# EAGLE design EuroWizard (EAGLE 9.5.2)
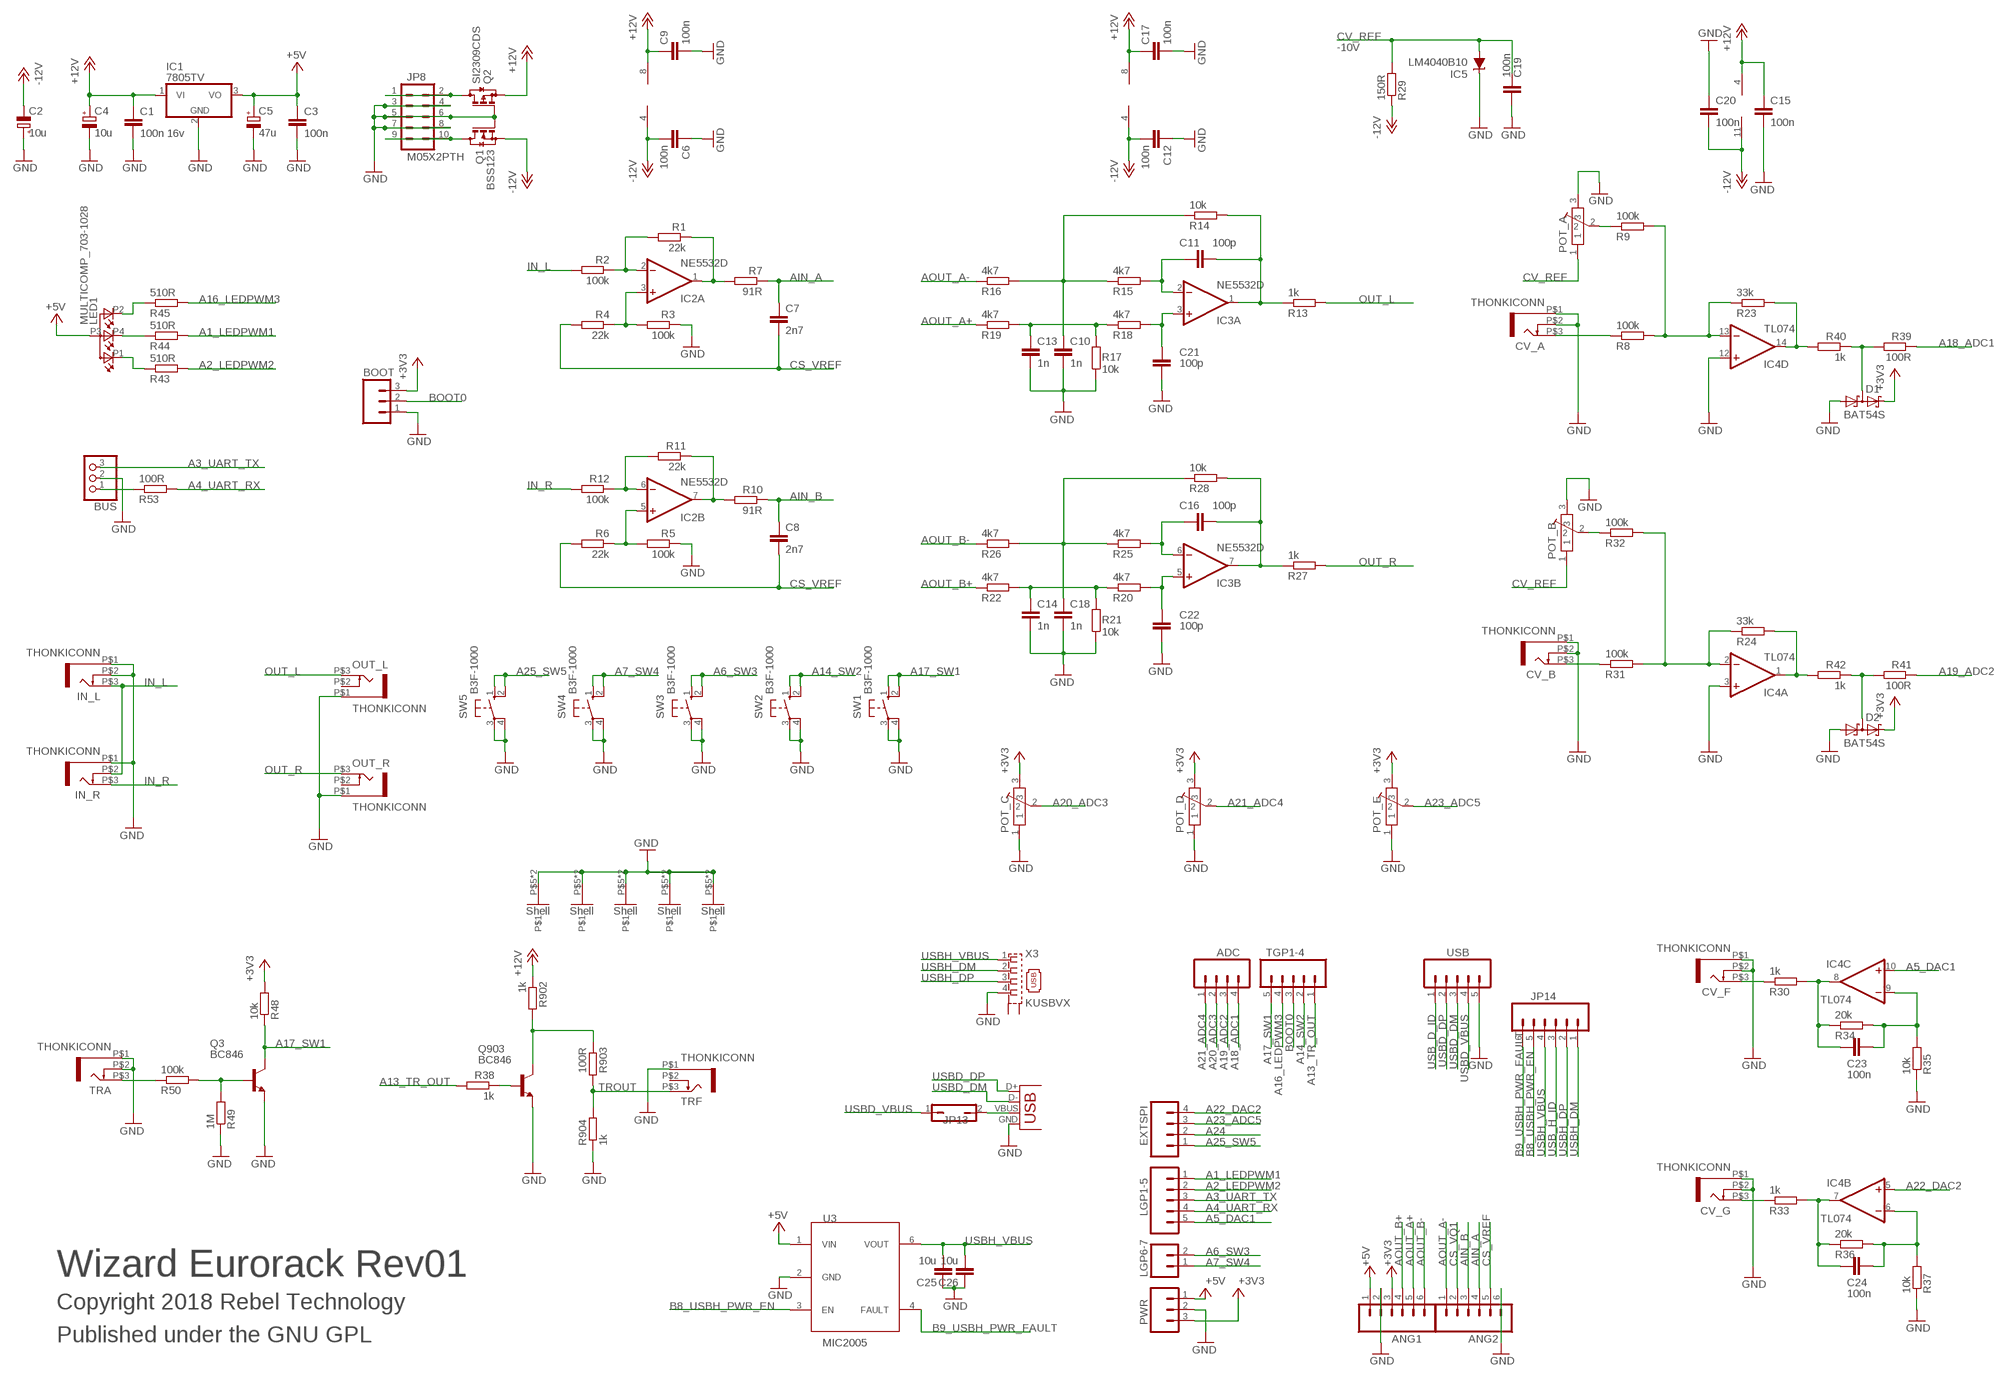
[diagram p0: schematic, sheet 1]

## Parts
ADC  M04PTH  [1X04]
ANG1  M06SIP  [1X06]
ANG2  M06SIP  [1X06]
BOOT  M03PTH  [1X03]
BUS  CON-JST-1X03PH-TH  [JST-B3B-PH-KL]
C1  100n 16v  C-EUC0603  [C0603]
C2  10u  CPOL-EUUD-4X5,8  [UD-4X5,8_NICHICON]
C3  100n  C-EUC0603  [C0603]
C4  10u  CPOL-EUUD-4X5,8  [UD-4X5,8_NICHICON]
C5  47u  CPOL-EUUD-4X5,8  [UD-4X5,8_NICHICON]
C6  100n  C-EUC0603  [C0603]
C7  2n7  C-EUC0603  [C0603]
C8  2n7  C-EUC0603  [C0603]
C9  100n  C-EUC0603  [C0603]
C10  1n  C-EUC0603  [C0603]
C11  100p  C-EUC0603  [C0603]
C12  100n  C-EUC0603  [C0603]
C13  1n  C-EUC0603  [C0603]
C14  1n  C-EUC0603  [C0603]
C15  100n  C-EUC0603  [C0603]
C16  100p  C-EUC0603  [C0603]
C17  100n  C-EUC0603  [C0603]
C18  1n  C-EUC0603  [C0603]
C19  100n  C-EUC0603  [C0603]
C20  100n  C-EUC0603  [C0603]
C21  100p  C-EUC0603  [C0603]
C22  100p  C-EUC0603  [C0603]
C23  100n  C-EUC0603  [C0603]
C24  100n  C-EUC0603  [C0603]
C25  10u  C-EUC0603  [C0603]
C26  10u  C-EUC0603  [C0603]
CV_A  THONKICONN  [THONKICONN]
CV_B  THONKICONN  [THONKICONN]
CV_F  THONKICONN  [THONKICONN]
CV_G  THONKICONN  [THONKICONN]
D1  BAT54S  [SOT23]
D2  BAT54S  [SOT23]
EXTSPI  M04PTH  [1X04]
IC1  7805TV  [TO220V]
IC2  NE5532D  [SO08]
IC3  NE5532D  [SO08]
IC4  TL074  QUAD_OPAMPD  [SO14]
IC5  LM4040B10  LM4041C12DBZ  [DBZ_R-PDSO-G3]
IN_L  THONKICONN  [THONKICONN]
IN_R  THONKICONN  [THONKICONN]
JP8  M05X2PTH  [AVR_ICSP]
JP13  JP1Q  [JP1]
JP14  M06SIP  [1X06]
LED1  MULTICOMP_703-1028  [RGB-LED-703-1028]
LGP1-5  M05PTH  [1X05]
LGP6-7  M02PTH  [1X02]
OUT_L  THONKICONN  [THONKICONN]
OUT_R  THONKICONN  [THONKICONN]
POT_A  POT-ALPS-RK09L1140  [POT-ALPS-RK09L1140]
POT_B  POT-ALPS-RK09L1140  [POT-ALPS-RK09L1140]
POT_C  POT-ALPS-RK09L1140  [POT-ALPS-RK09L1140]
POT_D  POT-ALPS-RK09L1140  [POT-ALPS-RK09L1140]
POT_E  POT-ALPS-RK09L1140  [POT-ALPS-RK09L1140]
PWR  M03PTH  [1X03]
Q1  BSS123  [SOT23]
Q2  SI2309CDS  BSS84  [SOT23]
Q3  BC846  [SOT23]
Q903  BC846  [SOT23]
R1  22k  R-EU_0603  [0603]
R2  100k  R-EU_0603  [0603]
R3  100k  R-EU_0603  [0603]
R4  22k  R-EU_0603  [0603]
R5  100k  R-EU_0603  [0603]
R6  22k  R-EU_0603  [0603]
R7  91R  R-EU_0603  [0603]
R8  100k  R-EU_0603  [0603]
R9  100k  R-EU_0603  [0603]
R10  91R  R-EU_0603  [0603]
R11  22k  R-EU_0603  [0603]
R12  100k  R-EU_0603  [0603]
R13  1k  R-EU_0603  [0603]
R14  10k  R-EU_0603  [0603]
R15  4k7  R-EU_0603  [0603]
R16  4k7  R-EU_0603  [0603]
R17  10k  R-EU_0603  [0603]
R18  4k7  R-EU_0603  [0603]
R19  4k7  R-EU_0603  [0603]
R20  4k7  R-EU_0603  [0603]
R21  10k  R-EU_0603  [0603]
R22  4k7  R-EU_0603  [0603]
R23  33k  R-EU_0603  [0603]
R24  33k  R-EU_0603  [0603]
R25  4k7  R-EU_0603  [0603]
R26  4k7  R-EU_0603  [0603]
R27  1k  R-EU_0603  [0603]
R28  10k  R-EU_0603  [0603]
R29  150R  R-EU_0603  [0603]
R30  1k  R-EU_0603  [0603]
R31  100k  R-EU_0603  [0603]
R32  100k  R-EU_0603  [0603]
R33  1k  R-EU_0603  [0603]
R34  20k  R-EU_0603  [0603]
R35  10k  R-EU_0603  [0603]
R36  20k  R-EU_0603  [0603]
R37  10k  R-EU_0603  [0603]
R38  1k  R-EU_0603  [0603]
R39  100R  R-EU_0603  [0603]
R40  1k  R-EU_0603  [0603]
R41  100R  R-EU_0603  [0603]
R42  1k  R-EU_0603  [0603]
R43  510R  R-EU_0603  [0603]
R44  510R  R-EU_0603  [0603]
R45  510R  R-EU_0603  [0603]
R48  10k  R-EU_0603  [0603]
R49  1M  R-EU_0603  [0603]
R50  100k  R-EU_0603  [0603]
R53  100R  R-EU_0603  [0603]
R902  1k  R-EU_0603  [0603]
R903  100R  R-EU_0603  [0603]
R904  1k  R-EU_0603  [0603]
SW1  B3F-1000  10-XX  [B3F-10XX]
SW2  B3F-1000  10-XX  [B3F-10XX]
SW3  B3F-1000  10-XX  [B3F-10XX]
SW4  B3F-1000  10-XX  [B3F-10XX]
SW5  B3F-1000  10-XX  [B3F-10XX]
TGP1-4  M05PTH  [1X05]
TRA  THONKICONN  [THONKICONN]
TRF  THONKICONN  [THONKICONN]
U3  MIC2005  [SOT23-6]
USB  M05PTH  [1X05]
X3  KUSBVX  [KUSBVX]
X5  USBPTH-VERTICAL  [USB-B-PTH-VERTICAL]

## Nets
+3V3: ANG1.3 BOOT.3 D1.2(C2) D2.2(C2) POT_C.3 POT_D.3 POT_E.3 PWR.3 R48.2
+5V: ANG1.1 C3.1 C5.+ IC1.3(VO) LED1.P3(A) PWR.1 U3.1(VIN)
+12V: C1.1 C4.+ C9.1 C15.1 C17.1 IC1.1(VI) IC2.8(P:V+) IC3.8(P:V+) IC4.4(P:V+) Q2.2(S) R902.1
-12V: C2.- C6.2 C12.2 C20.2 IC2.4(P:V-) IC3.4(P:V-) IC4.11(P:V-) Q1.2(S) R29.1
A1_LEDPWM1: LGP1-5.1 R44.2
A2_LEDPWM2: LGP1-5.2 R43.2
A3_UART_TX: BUS.3 LGP1-5.3
A4_UART_RX: LGP1-5.4 R53.2
A5_DAC1: IC4.10(C:+IN) LGP1-5.5
A6_SW3: LGP6-7.2 SW3.1(S) SW3.2(S1)
A7_SW4: LGP6-7.1 SW4.1(S) SW4.2(S1)
A13_TR_OUT: R38.2 TGP1-4.1
A14_SW2: SW2.1(S) SW2.2(S1) TGP1-4.2
A16_LEDPWM3: R45.2 TGP1-4.4
A17_SW1: Q3.3(C) R48.1 SW1.1(S) SW1.2(S1) TGP1-4.5
A18_ADC1: ADC.4 R39.1
A19_ADC2: ADC.3 R41.1
A20_ADC3: ADC.2 POT_C.2
A21_ADC4: ADC.1 POT_D.2
A22_DAC2: EXTSPI.4 IC4.5(B:+IN)
A23_ADC5: EXTSPI.3 POT_E.2
A24: EXTSPI.2
A25_SW5: EXTSPI.1 SW5.1(S) SW5.2(S1)
AIN_A: ANG2.4 C7.1 R7.1
AIN_B: ANG2.3 C8.1 R10.1
AOUT_A+: ANG1.5 R19.1
AOUT_A-: ANG2.1 R16.1
AOUT_B+: ANG1.4 R22.1
AOUT_B-: ANG1.6 R26.1
B8_USBH_PWR_EN: JP14.5 U3.3(EN)
B9_USBH_PWR_FAULT: JP14.6 U3.4(FAULT)
BOOT0: BOOT.2 TGP1-4.3
CS_VQ1: ANG2.2
CS_VREF: ANG2.5 C7.2 C8.2 R4.2 R6.2
CV_REF: C19.1 IC5.2(A) POT_A.1 POT_B.1 R29.2
EXT_UART_RX: BUS.1 R53.1
GND: ANG1.2 ANG2.6 BOOT.1 BUS.2 C1.2 C2.+ C3.2 C4.- C5.- C6.1 C9.2 C10.2 C12.1 C13.2 C14.2 C15.2 C17.2 C18.2 C19.2 C20.1 C21.2 C22.2 C25.1 C26.1 CV_A.P$1 CV_A.P$2 CV_B.P$1 CV_B.P$2 CV_F.P$1 CV_F.P$2 CV_G.P$1 CV_G.P$2 D1.1(A1) D2.1(A1) IC1.2(GND) IC4.3(A:+IN) IC4.12(D:+IN) IC5.1(C) IN_L.P$1 IN_L.P$2 IN_R.P$1 JP8.3 JP8.4 JP8.5 JP8.6 JP8.7 JP8.8 OUT_L.P$1 OUT_R.P$1 POT_A.3 POT_A.P$5 POT_A.P$6 POT_B.3 POT_B.P$5 POT_B.P$6 POT_C.1 POT_C.P$5 POT_C.P$6 POT_D.1 POT_D.P$5 POT_D.P$6 POT_E.1 POT_E.P$5 POT_E.P$6 PWR.2 Q1.1(G) Q2.1(G) Q3.2(E) Q903.2(E) R3.1 R5.1 R17.1 R21.1 R35.1 R37.1 R49.1 R904.1 SW1.3(P) SW1.4(P1) SW2.3(P) SW2.4(P1) SW3.3(P) SW3.4(P1) SW4.3(P) SW4.4(P1) SW5.3(P) SW5.4(P1) TRA.P$1 TRA.P$2 TRF.P$1 U3.2(GND) USB.5 X3.4 X5.GND
IN_L: IN_L.P$3 IN_R.P$2 R2.2
IN_R: IN_R.P$3 R12.2
N$1: IC2.1(A:OUT) R1.1 R7.2
N$2: IC2.3(A:+IN) R3.2 R4.1
N$3: CV_A.P$3 R8.1
N$4: IC2.5(B:+IN) R5.2 R6.1
N$5: IC2.6(B:-IN) R11.2 R12.1
N$6: CV_F.P$3 R30.1
N$7: C11.1 IC3.2(A:-IN) R15.2
N$8: JP8.9 JP8.10 Q1.3(D)
N$9: IC2.2(A:-IN) R1.2 R2.1
N$10: IC2.7(B:OUT) R10.2 R11.1
N$11: C21.1 IC3.3(A:+IN) R18.2
N$12: JP8.1 JP8.2 Q2.3(D)
N$13: IC4.13(D:-IN) R8.2 R9.2 R23.1
N$14: POT_A.2 R9.1
N$15: C13.1 R17.2 R18.1 R19.2
N$16: D1.3(C1A2) R39.2 R40.1
N$17: IC4.14(D:OUT) R23.2 R40.2
N$18: C16.2 IC3.7(B:OUT) R27.1 R28.2
N$19: CV_B.P$3 R31.1
N$20: IC4.2(A:-IN) R24.1 R31.2 R32.2
N$21: POT_B.2 R32.1
N$22: IC4.1(A:OUT) R24.2 R42.2
N$23: D2.3(C1A2) R41.2 R42.1
N$24: C18.1 R25.1 R26.2 R28.1
N$25: C23.2 IC4.8(C:OUT) R30.2 R34.1
N$26: C16.1 IC3.6(B:-IN) R25.2
N$27: JP13.2 X5.VBUS
N$28: CV_G.P$3 R33.1
N$29: C23.1 IC4.9(C:-IN) R34.2 R35.2
N$30: C22.1 IC3.5(B:+IN) R20.2
N$31: C24.2 IC4.7(B:OUT) R33.2 R36.1
N$32: C14.1 R20.1 R21.2 R22.2
N$33: C24.1 IC4.6(B:-IN) R36.2 R37.2
N$37: Q3.1(B) R49.2 R50.2
N$39: C11.2 IC3.1(A:OUT) R13.1 R14.2
N$40: LED1.P1(CRED) R43.1
N$41: C10.1 R14.1 R15.1 R16.2
N$42: LED1.P2(CGREEN) R45.1
N$43: LED1.P4(CBLUE) R44.1
N$46: R50.1 TRA.P$3
N$47: Q903.1(B) R38.1
N$51: Q903.3(C) R902.2 R903.1
OUT_L: OUT_L.P$3 R13.2
OUT_R: OUT_R.P$3 R27.2
TROUT: R903.2 R904.2 TRF.P$3
USB_D_ID: USB.1
USB_H_ID: JP14.3
USBD_DM: USB.3 X5.D-
USBD_DP: USB.2 X5.D+
USBD_VBUS: JP13.1 USB.4
USBH_DM: JP14.1 X3.2
USBH_DP: JP14.2 X3.3
USBH_VBUS: C25.2 C26.2 JP14.4 U3.6(VOUT) X3.1
Unconnected: OUT_L.P$2 OUT_R.P$2 TRF.P$2 X3.M1(S1) X3.M2(S2)

## Notes on the sheet
- -10V
- Wizard Eurorack Rev01
- Copyright 2018 Rebel Technology
- Published under the GNU GPL

## Library data of the parts
ADC EXTSPI = SparkFun:M04: Header 4 Standard 4-pin 0.1" header. Use with straight break away headers (SKU : PRT-00116), right angle break away headers (PRT-00553), swiss pins (PRT-00743), machine pins (PRT-00117), and female headers (PRT-00115). Molex polarized connector foot print use with SKU : PRT-08231 with associated crimp pins and housings. 1MM SMD Version SKU: PRT-10208
ANG1 ANG2 JP14 = SparkFun:M06: Header 6 Standard 6-pin 0.1" header. Use with straight break away headers (SKU : PRT-00116), right angle break away headers (PRT-00553), swiss pins (PRT-00743), machine pins (PRT-00117), and female headers (PRT-00115). Molex polarized connector foot print use with SKU : PRT-08094 with associated crimp pins and housings. NOTES ON THE VARIANTS LOCK and LOCK_LONGPADS... This footprint was designed to help hold the alignment of a through-hole component (i.e. 6-pin header) while soldering it into place. You may notice that each hole has been shifted either up or down by 0.005 of an inch from it's more standard position (which is a perfectly straight line). This slight alteration caused the pins (the squares in the middle) to touch the edges of the holes. Because they are alternating, it causes a "brace" to hold the component in place. 0.005 has proven to be the perfect amount of "off-center" position when using our standard breakaway headers. Although looks a little odd when you look at the bare footprint, once you have a header in there, the alteration is very hard to notice. Also, if you push a header all the way into place, it is covered up entirely on the bottom side. This idea of altering the position of holes to aid alignment will be further integrated into the Sparkfun Library for other footprints. It can help hold any component with 3 or more connection pins.
BOOT PWR = SparkFun:M03: Header 3 Standard 3-pin 0.1" header. Use with straight break away headers (SKU : PRT-00116), right angle break away headers (PRT-00553), swiss pins (PRT-00743), machine pins (PRT-00117), and female headers (PRT-00115). Molex polarized connector foot print use with SKU : PRT-08232 with associated crimp pins and housings.
BUS = Rebel:CON-JST-1X03
C1 C3 C23 C24 = Rebel:C-EU: CAPACITOR, European symbol
C2 C4 = Rebel:CPOL-EU: POLARIZED CAPACITOR, European symbol
C5 = rcl:CPOL-EU: POLARIZED CAPACITOR, European symbol
C6-C22 C25 C26 = resistor:C-EU: CAPACITOR, European symbol
CV_A CV_B CV_F CV_G IN_L IN_R OUT_L OUT_R TRA TRF = Rebel:THONKICONN
D1 D2 = diode:BAT54S: Schottky Diodes Pin connection corrected 2011-05-04 Source: Fairchild .. BAT54.pdf
IC1 = linear:78*: Positive VOLTAGE REGULATOR Source: http://cache.national.com/ds/LM/LM78L05.pdf http://www.fairchildsemi.com/ds/LM/LM7805.pdf
IC2 IC3 = linear:NE5532: AUDIO AMPLIFIER
IC4 = adafruit:QUAD_OPAMP: OP AMP Standard quad package
IC5 = texas:LM4041: PRECISION MICROPOWER SHUNT VOLTAGE REFERENCE Source: http://focus.ti.com/lit/ds/slcs146e/slcs146e.pdf; MF: TEXAS INSTRUMENT CONNECTORS; MPN: LM4041C12QDBZT; OC_FARNELL: 1771733; OC_NEWARK: 43K3376
JP8 = SparkFun:M05X2: Header 5x2 Standard 10-pin dual row 0.1" header. Commonly used with AVR-ISP. Use with Spark Fun Electronics SKU: PRT-00778
JP13 = jumper:JP1Q: JUMPER
LED1 = Rebel:MULTICOMP_703-1028: Farnell: 2112143
LGP1-5 TGP1-4 USB = SparkFun:M05: Header 5 Standard 5-pin 0.1" header. Use with straight break away headers (SKU : PRT-00116), right angle break away headers (PRT-00553), swiss pins (PRT-00743), machine pins (PRT-00117), and female headers (PRT-00115). Molex polarized connector foot print use with SKU : PRT-08230 with associated crimp pins and housings.
LGP6-7 = SparkFun:M02: Header 2 Standard 2-pin 0.1" header. Use with straight break away headers (SKU : PRT-00116), right angle break away headers (PRT-00553), swiss pins (PRT-00743), machine pins (PRT-00117), and female headers (PRT-00115). Molex polarized connector foot print use with SKU : PRT-08233 with associated crimp pins and housings.
POT_A POT_B POT_C POT_D POT_E = Rebel:POT-ALPS-RK09L
Q1 = transistor-small-signal:BSS123: N-CHANNEL MOS FET; OC_FARNELL: 1843725
Q2 = transistor-small-signal:BSS84: P-CHANNEL MOS FET; OC_FARNELL: 1779264
Q3 Q903 = transistor:BC846: NPN TRANSISTOR
R1-R45 R48-R50 R53 R902-R904 = Rebel:R-EU_: RESISTOR, European symbol
SW1-SW5 = switch-omron:10-XX: OMRON SWITCH; MPN: B3F-1000; OC_FARNELL: 176432; OC_NEWARK: 36M3542
U3 = James:MIC2005; OC_FARNELL: 2509882
X3 = con-kycon:KUSBVX: Vertical,Top Entry Universal Serial Bus Connector KUSBVX Series Source: KYCON Sibalco USB vertical socket KUSBV.pdf
X5 = SparkFun:USB: USB Connectors USB-B-PTH is fully proven SKU : PRT-00139 USB-miniB is fully proven SKU : PRT-00587 USB-A-PCB is untested. USB-A-H is throughly reviewed, but untested. Spark Fun Electronics SKU : PRT-00437 USB-B-SMT is throughly reviewed, but untested. Needs silkscreen touching up. USB-A-S has not been used/tested USB-MB-H has not been used/tested

## Net classes
1 power: width 0.178 mm, drill 0.305 mm, clearance 0.178 mm to class 0, clearance 0.178 mm

## Board
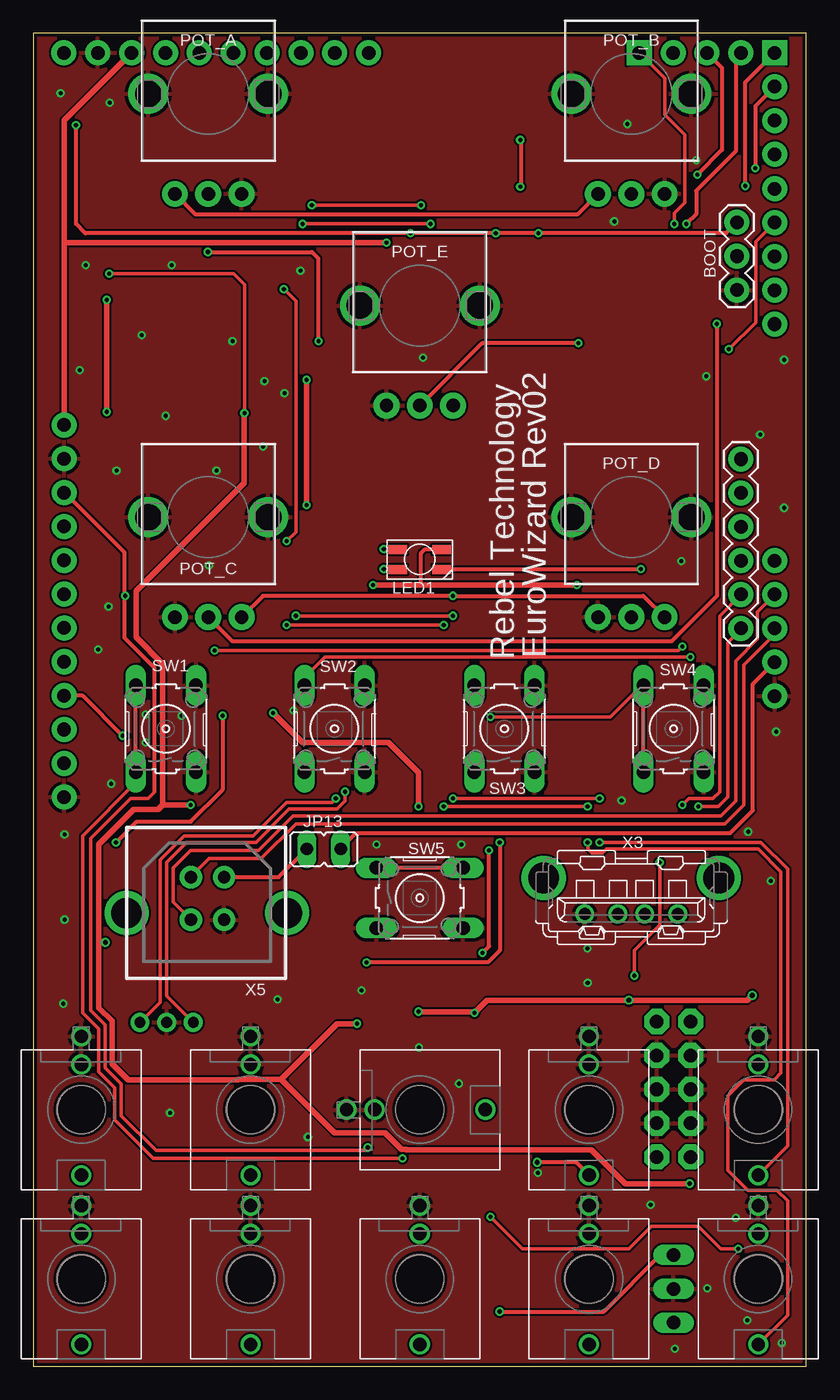
[diagram p1: board, top side]
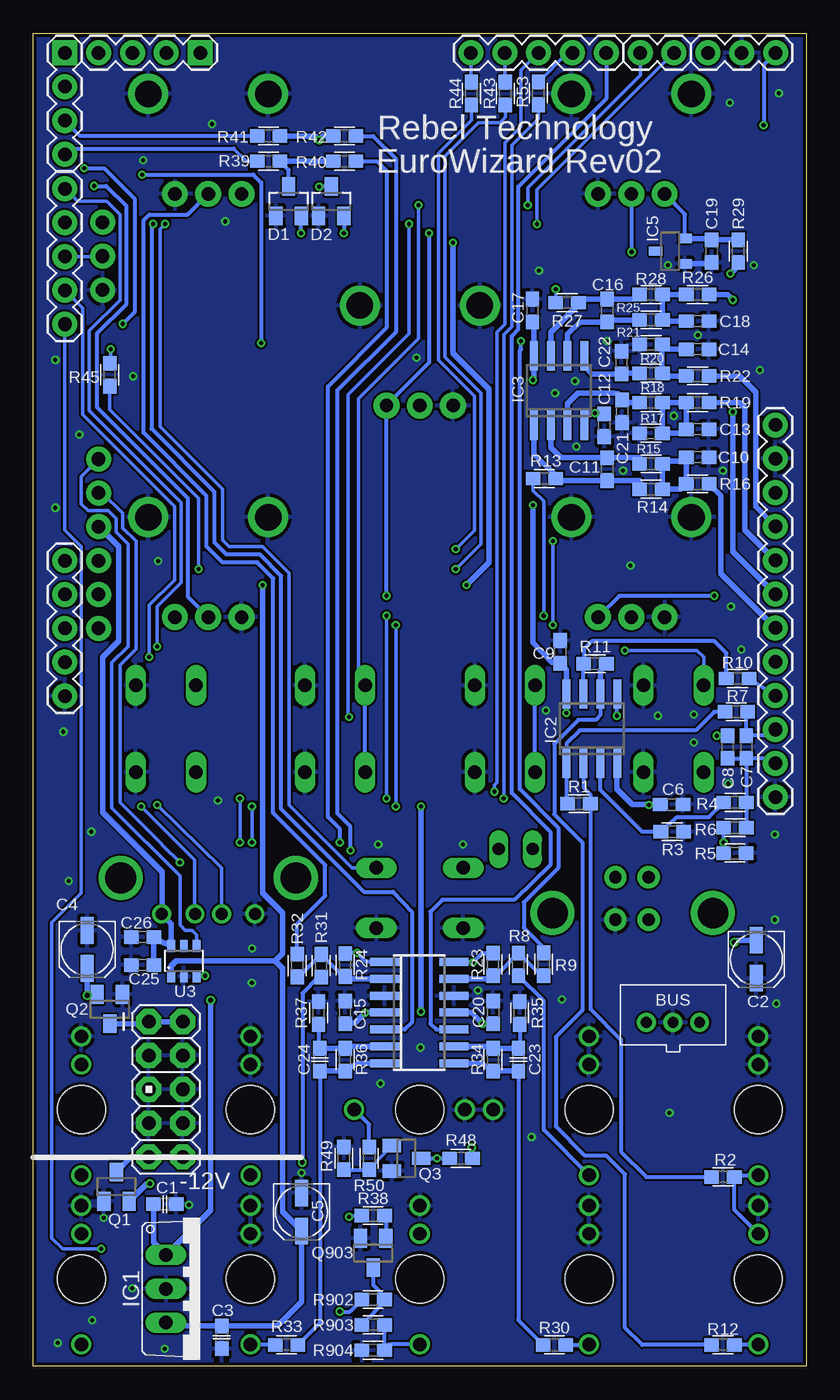
[diagram p2: board, bottom side, seen from below]

Size 58 x 100 mm. Coordinates in mm from the lower left corner, seen from the top.
Outline: 0,0 58,0 58,100 0,100 0,0
Copper layers (1*16): Top 0.035mm / dielectric 1.5mm / Bottom 0.035mm
Design rules "SeeedStudio_2layer_DRU_no_angle_20140221": minimum track width 6mil, minimum drill 12mil, track to track 6mil, track to pad 6mil, pad to pad 6mil, via to via 6mil, smd to smd 0mil, copper to edge 10mil, drill to drill 10mil, minimum pad ring 10mil, minimum via ring 6mil, stop-mask expansion 2mil, vias tented up to drill 100mil, thermal gap 10mil

### Footprints (pad centres in the part's own frame; a part is rotated, then mirrored left to right if it is on the bottom)
1X04 = drill 1.016 pad 1.88 square: 1 0,0 | drill 1.016 pad 1.88: 2 2.54,0; 3 5.08,0; 4 7.62,0
1X06 = drill 1.016 pad 1.88: 1 0,0; 2 2.54,0; 3 5.08,0; 4 7.62,0; 5 10.16,0; 6 12.7,0
1X03 = drill 1.016 pad 1.88: 1 0,0; 2 2.54,0; 3 5.08,0
JST-B3B-PH-KL = drill 0.8 pad 1.422: 1 2,0; 2 0,0; 3 -2,0
C0603 = smd 1.1 x 1: 1 -0.85,0; 2 0.85,0
UD-4X5,8_NICHICON = smd 2 x 1: + 1.425,0; - -1.425,0
THONKICONN = drill 1: P$1 0,-5.5; P$2 0,-3.38; P$3 0,4.92 | hole 3.6: 0,0
SOT23 = smd 1 x 1.4: 1 -0.95,-1.1; 2 0.95,-1.1; 3 0,1.1
TO220V = drill 1.016 long: 1 -2.54,-2.54; 2 0,-2.54; 3 2.54,-2.54
SO08 = smd 0.6 x 2.2: 1 -1.905,-2.6; 2 -0.635,-2.6; 3 0.635,-2.6; 4 1.905,-2.6; 5 1.905,2.6; 6 0.635,2.6; 7 -0.635,2.6; 8 -1.905,2.6
SO14 = smd 0.6 x 2.2: 1 -3.81,-2.6; 2 -2.54,-2.6; 3 -1.27,-2.6; 4 0,-2.6; 5 1.27,-2.6; 6 2.54,-2.6; 7 3.81,-2.6; 8 3.81,2.6; 9 2.54,2.6; 10 1.27,2.6; 11 0,2.6; 12 -1.27,2.6; 13 -2.54,2.6; 14 -3.81,2.6
DBZ_R-PDSO-G3 = smd 0.7 x 1: 1 -0.95,-1.1; 2 0.95,-1.1; 3 0,1.1
AVR_ICSP = drill 1.016 pad 1.88 octagon: 1 -1.27,5.08; 2 1.27,5.08; 3 -1.27,2.54; 4 1.27,2.54; 5 -1.27,0; 6 1.27,0; 7 -1.27,-2.54; 8 1.27,-2.54; 9 -1.27,-5.08; 10 1.27,-5.08
JP1 = drill 0.914 long: 1 0,-1.27; 2 0,1.27
RGB-LED-703-1028 = smd 0.7 x 1.4: P1 -0.75,1.65; P2 -0.75,-1.65; P3 0.75,-1.65; P4 0.75,1.65
1X05 = drill 1.016 pad 1.88: 1 0,0; 2 2.54,0; 3 5.08,0; 4 7.62,0; 5 10.16,0
1X02 = drill 1.016 pad 1.88: 1 0,0; 2 2.54,0
POT-ALPS-RK09L1140 = drill 1 pad 1.93: 1 -2.5,-7.5; 2 0,-7.5; 3 2.5,-7.5 | drill 2: P$5 -4.5,0; P$6 4.5,0
0603 = smd 1.1 x 1: 1 -0.85,0; 2 0.85,0
B3F-10XX = drill 1.016 long: 1 -3.251,2.261; 2 3.251,2.261; 3 -3.251,-2.261; 4 3.251,-2.261
SOT23-6 = smd 0.6 x 0.9: 1 -0.95,-1.15; 2 0,-1.15; 3 0.95,-1.15; 4 0.95,1.15; 5 0,1.15; 6 -0.95,1.15
KUSBVX = drill 0.9 pad 1.3: 1 3.5,0; 2 1,0; 3 -1,0; 4 -3.5,0 | drill 2.3 pad 2.8: M1 -6.57,2.71; M2 6.57,2.71
USB-B-PTH-VERTICAL = drill 0.914 pad 1.676: D+ 4.826,4.394; D- 4.826,7.595; GND 7.315,4.394; VBUS 7.315,7.595 | drill 2.286: P$1 0,4.902; P$2 12.04,4.902

### Placement (x,y rotation side)
ADC  55.64,98.54 270 bottom
ANG1  2.31,70.62 270 bottom
ANG2  2.31,55.39 270 bottom
BOOT  52.8,80.74 90 top
BUS  10,25.8 0 bottom
C1  48.13,12.16 0 bottom
C2  3.74,30.53 270 bottom
C3  43.86,2.17 270 bottom
C4  53.96,31.27 270 bottom
C5  37.87,11.57 270 bottom
C6  10.1,42.14 180 bottom
C7  4.5,46.46 270 bottom
C8  5.9,46.46 270 bottom
C9  18.46,53.6 90 bottom
C10  8.14,68.2 0 bottom
C11  14.94,67.3 270 bottom
C12  15.16,70.6 90 bottom
C13  8.14,70.3 0 bottom
C14  8.14,76.3 0 bottom
C15  34.6,26.54 90 bottom
C16  14.94,79.2 90 bottom
C17  20.54,79.2 90 bottom
C18  8.14,78.4 0 bottom
C19  7.1,83.66 270 bottom
C20  23.5,26.54 270 bottom
C21  13.82,71.64 270 bottom
C22  13.86,75.29 90 bottom
C23  21.6,23 270 bottom
C24  36.5,23 270 bottom
C25  49.8,30.1 0 bottom
C26  49.8,32.2 0 bottom
CV_A  16.3,19.25 180 top
CV_B  41.7,19.25 180 top
CV_F  16.3,6.55 180 top
CV_G  41.7,6.55 180 top
D1  38.84,87.4 0 bottom
D2  35.64,87.4 0 bottom
EXTSPI  45.48,98.54 180 bottom
IC1  45.5,5.8 270 bottom
IC2  16.08,47.83 0 bottom
IC3  18.54,73.2 0 bottom
IC4  29.03,26.53 270 bottom
IC5  10.2,83.66 90 bottom
IN_L  3.6,19.25 180 top
IN_R  3.6,6.55 180 top
JP8  48.06,20.77 0 bottom
JP13  21.8,38.8 90 top
JP14  53.1,55.36 90 top
LED1  29,60.52 90 top
LGP1-5  25.16,98.54 0 bottom
LGP6-7  9.92,98.54 180 bottom
OUT_L  54.4,19.25 180 top
OUT_R  54.4,6.55 180 top
POT_A  13.12,95.45 0 top
POT_B  44.88,95.45 0 top
POT_C  13.12,63.7 0 top
POT_D  44.88,63.7 0 top
POT_E  29,79.58 0 top
PWR  7.38,98.54 0 bottom
Q1  51.76,13.47 0 bottom
Q2  52.26,26.8 180 bottom
Q3  30,15.6 270 bottom
Q903  32.5,8.5 180 bottom
R1  17.04,42.2 0 bottom
R2  6.24,14.2 0 bottom
R3  10.06,40.1 180 bottom
R4  5.34,42.3 0 bottom
R5  5.36,38.5 180 bottom
R6  5.34,40.4 0 bottom
R7  5.24,49.1 180 bottom
R8  21.6,30.14 90 bottom
R9  19.7,30.16 270 bottom
R10  5.14,51.6 180 bottom
R11  15.84,52.7 0 bottom
R12  6.24,1.6 0 bottom
R13  19.64,66.6 180 bottom
R14  11.64,65.8 180 bottom
R15  11.64,67.7 180 bottom
R16  8.14,66.2 180 bottom
R17  11.64,70 0 bottom
R18  11.64,72.3 180 bottom
R19  8.14,72.3 180 bottom
R20  11.64,74.5 180 bottom
R21  11.64,76.65 0 bottom
R22  8.14,74.3 180 bottom
R23  23.5,30.14 90 bottom
R24  34.6,30.1 90 bottom
R25  11.64,78.5 180 bottom
R26  8.14,80.4 180 bottom
R27  17.94,79.8 180 bottom
R28  11.64,80.4 180 bottom
R29  5.1,83.66 90 bottom
R30  18.9,1.6 180 bottom
R31  36.4,30.04 90 bottom
R32  38.2,30.06 270 bottom
R33  39,1.6 0 bottom
R34  23.5,23 90 bottom
R35  21.5,26.5 270 bottom
R36  34.6,23 90 bottom
R37  36.6,26.5 270 bottom
R38  32.5,11.3 180 bottom
R39  40.34,90.4 0 bottom
R40  34.64,90.4 0 bottom
R41  40.34,92.3 0 bottom
R42  34.64,92.3 0 bottom
R43  22.58,95.48 90 bottom
R44  25.12,95.48 90 bottom
R45  52.26,74.38 90 bottom
R48  25.9,15.6 0 bottom
R49  34.7,15.6 270 bottom
R50  32.8,15.6 270 bottom
R53  20.1,95.5 90 bottom
R902  32.5,5 0 bottom
R903  32.5,3.1 0 bottom
R904  32.5,1.2 0 bottom
SW1  9.95,47.83 90 top
SW2  22.6,47.83 90 top
SW3  35.35,47.83 90 top
SW4  48.05,47.83 90 top
SW5  29,35.12 0 top
TGP1-4  55.64,78.18 90 bottom
TRA  29,19.25 270 top
TRF  29,6.55 180 top
U3  46.7,30.4 0 bottom
USB  55.64,60.44 270 bottom
X3  44.88,33.92 0 top
X5  7,29.1 0 top

### Tracks (layer width: path | path; a pad name or v marks a point on that pad's centre or on a via)
+3V3  (via drill 0.3)
  Top 0.254: v25.1,16.4 24.9,16.2 9.2,16.2 6.6,18.8 6.6,21.2 5.4,22.4 5.4,25.6 4.3,26.7 4.3,39.6 7.3,42.6 8.6,42.6 9.1,43.1
  Top 0.305: POT_D.3 45.77,57.8 v31.5,57.8 17.23,57.8 POT_C.3 | BOOT.3 51.98,85 v37.9,85 v34.7,85 v28.3,85 3.9,85 3.2,85.7 v3.2,93.1 | ANG1.3 2.36,65.54 6.85,61.05 6.85,57.75 | 9.1,43.1 9.1,52.4 6.85,54.65 6.85,57.75 | v6.9,57.8 6.85,57.75
  Bottom 0.254: R48.2 25.1,15.65 v25.1,16.4
  Bottom 0.305: v37.9,85 D1.2 | PWR.3 3.2,97.64 v3.2,93.1 | v28.3,85 28.3,75.3 31.5,72.1 POT_E.3 31.52,72.1 31.52,57.83 v31.5,57.8 | D2.2 v34.69,85.01 v34.7,85 | v6.9,57.8 14.03,57.8 POT_C.3
+5V  (via drill 0.3)
  Top 0.305: 29.1,58.6 29.1,61 29.4,61.3 30.62,61.3 LED1.P3
  Top 0.406: ANG1.1 2.31,84.3 | PWR.1 2.31,93.47 2.31,84.3 | v40.8,58.6 29.1,58.6 v25.5,58.6 | v26.5,84.3 2.31,84.3
  Bottom 0.406: v40.8,58.6 40.8,35.5 39.3,34 39.3,30.97 39.87,30.4 | v26.5,84.3 26.5,76 23.8,73.3 23.8,60.3 v25.5,58.6 | IC1.3 47.8,3.02 C3.1 39.68,3.02 37.87,4.83 C5.+ 39.3,11.58 39.3,29.83 39.87,30.4 | U3.1 47.65,30.04 47.29,30.4 39.87,30.4
+12V  (via drill 0.3, 0.35)
  Top 0.305: 33,26.6 v33.1,26.5 | 47.04,8.34 42.8,4.1 v35,4.1
  Top 0.406: v20.5,74 v20.5,64.6 | v18,49 20.2,46.8 26.65,46.8 28.9,44.55 v28.9,42 | v28.9,26.6 33,26.6 | v33.1,26.5 34.05,27.45 v44.69,27.45 53.59,27.45 v53.96,27.82 | 47.04,8.34 IC1.1
  Bottom 0.305: v35,4.1 34.25,4.1 R902.1 | C9.1 18.51,52.8 | 20.45,74.06 v20.5,74 | 17.98,49.02 v18,49 | 33.07,26.53 v33.1,26.5
  Bottom 0.406: C17.1 20.44,78.55 20.44,78.05 | 20.44,77.3 20.44,78.05 | 20.44,78.05 20.45,76.35 IC3.8 20.45,74.06 | 34.65,25.84 C15.1 34.55,25.74 33.86,25.74 v33.1,26.5 | C9.1 17.98,52.27 IC2.8 17.98,49.02 | 18.51,52.8 19.1,52.8 20.5,54.3 v20.5,64.6 | v28.9,42 v28.9,26.6 | IC4.4 33.07,26.53 | C1.1 48.98,9.28 IC1.1 44.69,11.69 v44.69,27.45 | C4.+ v53.96,27.82 53.28,27.82 Q2.2
-12V  (via drill 0.3, 0.35)
  Top 0.254: 15.8,71.44 v15.84,71.5 15.84,81.16 15.04,81.96 v5.7,81.96
  Top 0.406: 4.9,32 4.9,26.9 5.9,25.9 5.9,22.7 7.1,21.5 15.36,21.5 15.37,21.51 18.59,21.51 | 4.9,32 4.9,39.15 7.52,41.77 9.37,41.77 9.7,42.1 | 9.7,42.1 v11.8,42.1 | 9.7,42.1 9.7,52.7 7.7,54.7 7.7,58.14 15.8,66.24 15.8,71.44 | v5.4,31.8 5.1,31.8 4.9,32 | v49.26,13.7 44.43,13.7 41.89,16.24 27.99,16.24 27.97,16.26 27.65,16.26 26.4,17.51 22.59,17.51 18.59,21.51 | v24.3,25.7 22.79,25.7 18.59,21.51
  Bottom 0.254: v11.8,42.1 10.99,42.1 C6.2
  Bottom 0.305: 14.2,45.2 IC2.4
  Bottom 0.406: C12.2 15.79,71.45 | IC3.4 16.54,71.45 15.79,71.45 | v15.84,71.5 15.79,71.45 | v5.7,81.96 5.1,82.56 R29.1 | IC4.11 25.13,26.53 v24.3,25.7 C20.2 | C6.2 13.04,42.14 14.2,43.3 14.2,45.2 | C2.- 5.25,31.95 v5.4,31.8 | Q1.2 49.48,13.7 v49.26,13.7
A1_LEDPWM1
  Bottom 0.254: R44.2 25.16,96.37 LGP1-5.1
A2_LEDPWM2
  Bottom 0.254: R43.2 22.62,96.37 LGP1-5.2
A3_UART_TX  (via drill 0.3)
  Top 0.254: BUS.3 10,27.8 10,37.8 11.5,39.3 16.7,39.3 19.2,41.8 22.8,41.8 23.4,42.4 v23.4,43.1
  Bottom 0.254: LGP1-5.3 21.4,97.22 21.4,93 22.6,91.8 22.6,78.2 23.2,77.6 23.2,43.8 23.4,43.6 v23.4,43.1
A4_UART_RX
  Bottom 0.254: 17.5,98.54 LGP1-5.4 17.91,98.54 R53.2
A5_DAC1
  Bottom 0.305: LGP1-5.5 15,95.1 21.6,88.5 21.6,77.8 22.1,77.3 22.1,43 19.2,40.1 19.2,37.6 21.9,35 27.3,35 28.2,34.1 28.2,25.7 27.76,25.26 IC4.10
A6_SW3  (via drill 0.3)
  Top 0.254: v20.9,87.1 v29.1,87.1
  Bottom 0.254: LGP6-7.2 12.46,96.84 20.9,88.4 v20.9,87.1 | v29.1,87.1 29.1,77.1 33.61,72.59 33.61,51.59 SW3.2
  Bottom 0.305: SW3.1 SW3.2
A7_SW4  (via drill 0.3)
  Top 0.254: SW4.2 45.68,51.08 43.3,48.7 v34.3,48.7 | v29.8,85.7 v20.2,85.7
  Top 0.305: SW4.1 SW4.2
  Bottom 0.254: LGP6-7.1 20.2,88.25 v20.2,85.7 | v34.3,48.7 34.36,48.76 34.36,72.89 29.8,77.45 v29.8,85.7
A13_TR_OUT  (via drill 0.3)
  Top 0.254: v34.3,11.2 36.7,8.8 44.68,8.8 46.39,10.51 49.89,10.51 51.6,8.8 v52.9,8.8
  Bottom 0.254: TGP1-4.1 55.64,62.74 54.4,61.5 54.4,35.5 56.6,33.3 56.6,9.6 55.8,8.8 v52.9,8.8 | v34.3,11.2 34.2,11.3 R38.2
A14_SW2  (via drill 0.3)
  Top 0.254: v49.3,53.2 21.9,53.2 20.4,51.7 20.4,51.14 SW2.2
  Bottom 0.254: TGP1-4.2 54.3,79.38 54.3,71.4 47.4,64.5 47.4,59 49.3,57.1 v49.3,53.2
  Bottom 0.305: SW2.1 SW2.2
A16_LEDPWM3  (via drill 0.3)
  Top 0.254: TGP1-4.4 54.2,84.36 54.2,78.3 v52.2,76.3
  Bottom 0.254: v52.2,76.3 52.2,75.23 R45.2
A17_SW1  (via drill 0.3)
  Top 0.254: v13.61,53.7 48.4,53.7 v48.7,54 | SW1.1 7.69,43.79 3.7,39.8 3.7,26.5 4.9,25.3 4.9,22.1 6.1,20.9 6.1,18.5 9,15.6 v27.7,15.6
  Top 0.305: SW1.1 SW1.2
  Bottom 0.254: v48.7,54 48.7,57 46.9,58.8 46.9,64.8 53.8,71.7 53.8,77.7 51.5,80 51.5,86.4 52.49,87.39 54.69,87.39 TGP1-4.5 | v13.61,53.7 8.2,53.7 7.7,53.2 SW1.2
  Bottom 0.305: Q3.3 v27.7,15.6 R48.1
A18_ADC1
  Bottom 0.254: 42.96,91.36 42,90.4 R39.1
  Bottom 0.305: ADC.4 55.19,91.36 42.96,91.36
A19_ADC2
  Bottom 0.305: ADC.3 54.48,92.3 47.1,92.3 47.09,92.29 46.59,92.29 46.58,92.3 R41.1
A20_ADC3  (via drill 0.3)
  Top 0.305: POT_C.2 14.93,54.4 47.9,54.4 51.3,57.8 v51.3,78.2 | ADC.2 54.19,94.55 v54.19,89.87
  Bottom 0.305: v54.19,89.87 52.66,89.87 50.4,87.61 50.4,79.1 v51.3,78.2
A21_ADC4  (via drill 0.3)
  Top 0.305: v53.43,88.55 53.43,96.33 ADC.1
  Bottom 0.305: POT_D.2 46.4,57.73 46.4,65.1 53.2,71.9 53.2,77.5 51,79.7 51,87.02 52.53,88.55 v53.43,88.55
A22_DAC2  (via drill 0.3)
  Top 0.305: EXTSPI.4 53.1,98.52 52.7,98.12 52.7,91.14 49.74,88.19 49.74,86.44 v49,85.7
  Bottom 0.305: IC4.5 30.14,25.26 29.6,25.8 29.6,34.1 31,35.6 33.2,35.6 39.4,41.8 39.4,59.3 41,60.9 43.5,60.9 44.4,61.8 44.4,65.6 49.13,70.33 49.13,85.57 v49,85.7
A23_ADC5  (via drill 0.3)
  Top 0.305: EXTSPI.3 51.68,97.41 51.68,91.25 v49.83,89.4 | POT_E.2 33.67,76.75 v40.9,76.75
  Bottom 0.305: v49.83,89.4 41.5,89.4 40.9,88.8 v40.9,76.75
A25_SW5  (via drill 0.3)
  Top 0.254: EXTSPI.1 47.4,96.61 47.4,93.9 48.9,92.4 48.9,87.3 48.1,86.5 v48.1,85.7
  Top 0.305: SW5.2 SW5.1
  Bottom 0.254: SW5.2 34.09,37.39 38.8,42.1 38.8,59.5 40.8,61.5 43.3,61.5 43.8,62 43.8,65.8 48.48,70.48 48.48,85.32 v48.1,85.7
AIN_A
  Bottom 0.305: ANG2.4 2.77,47.31 C7.1 4.49,49 R7.1
AIN_B  (via drill 0.3)
  Top 0.305: v6.7,47.3 3.69,50.31 ANG2.3
  Bottom 0.305: 3.1,50.31 ANG2.3 R10.1 | v6.7,47.3 C8.1
AOUT_A+
  Bottom 0.406: 2.28,60.46 ANG1.5 4.6,62.75 4.6,71.9 5,72.3 R19.1
AOUT_A-
  Bottom 0.406: ANG2.1 6.4,59.48 6.4,65.31 R16.1
AOUT_B+
  Bottom 0.406: 2.34,62.96 2.34,63 ANG1.4 3.8,64.49 3.8,73.1 5,74.3 R22.1
AOUT_B-  (via drill 0.3)
  Top 0.406: v5.5,71.6 v5.5,80
  Bottom 0.406: ANG1.6 5.5,61.11 v5.5,71.6 | R26.1 5.9,80.4 v5.5,80
B8_USBH_PWR_EN  (via drill 0.3)
  Top 0.254: v47,37.8 47,33.1 45.1,31.2 v45.1,29.3
  Bottom 0.254: JP14.5 52.82,65.52 51.3,64 51.3,62.9 50.3,61.9 50.3,53.8 51.5,52.6 51.5,42.3 48.5,39.3 48.25,39.05 v47,37.8 | U3.3 45.25,29.25 v45.1,29.3
B9_USBH_PWR_FAULT
  Bottom 0.254: U3.4 45.75,32.35 46.1,32.7 46.6,32.7 47,33.1 47,36.8 52.1,41.9 52.1,52.8 50.9,54 50.9,61.7 51.8,62.6 51.8,63.6 52.4,64.2 53.9,64.2 54.4,64.7 54.4,66.75 JP14.6
BOOT0
  Bottom 0.254: BOOT.2 52.82,83.26 TGP1-4.3
CS_VREF
  Bottom 0.305: C8.2 C7.2 | C7.2 R4.2 R6.2 | ANG2.5 2.69,45.61 C7.2
CV_REF
  Top 0.305: POT_B.1 40.83,86.4 12.18,86.4 POT_A.1
  Bottom 0.305: 7.1,84.61 C19.1 | IC5.2 9.1,86.42 POT_A.1
  Bottom 0.406: R29.2 C19.1 | 7.1,84.61 IC5.2
EXT_UART_RX  (via drill 0.3)
  Top 0.254: BUS.1 9.5,27.3 9.5,38 11.3,39.8 16.5,39.8 19,42.3 22.4,42.3 v22.7,42.6
  Bottom 0.254: R53.1 20.1,93.6 22.1,91.6 22.1,78 22.7,77.4 v22.7,42.6
GND  (via drill 0.3)
  Bottom 0.305: 7.2,82.71 C19.2
  Bottom 0.406: IC5.1 7.2,82.71
  other vias: 18.84,73 11.14,48.8 10.39,82.61 19.54,49.2 46.32,12.11 50.57,5.84 6.24,67.2 9.94,71.3 13.74,67.2 17.24,69 17.34,73.9 8.14,77.36 14.94,76.9 53.57,3.44 52.71,11.14 4.88,53.77 5.64,57 8.44,48.9 8.44,46.8 5.84,43.7 2.34,39.9 2.24,27.2 2.34,33.5 24.64,28.2 56.17,1.74 55.74,47.6 53.64,40.1 55.34,36.4 10.25,19 48.14,1.3 41.58,31.33 20.6,17.19 41.6,28.75 13.18,60.08 2.04,95.5 5.74,94.8 3.94,82.6 3.47,74.73 20.04,82.2 44.59,93.2 49.76,90.49 43.59,85.89 54.54,69.9 56.34,75.5 56.34,64.4 48.64,60.4 44.15,42.44 31.94,21.2 28.94,23.9 18.34,27.52 32.11,39.14 25.77,39.14 37.86,14.5 29.25,75.66 50.51,74.27
  pour Bottom: -1.16,-0.97 -1.16,101.3 59.44,101.3 59.44,-0.97
  pour Top: -1.06,-0.97 -0.96,101.3 59.04,101.3 58.94,-0.97
IN_L
  Bottom 0.305: IN_L.P$3 5.39,14.33 R2.2 5.39,11.72 IN_R.P$2
IN_R
  Bottom 0.305: R12.2 5.39,1.63 IN_R.P$3
N$1
  Bottom 0.305: R7.2 6.9,49.1 8.3,47.7 17,47.7 17.98,46.72 IC2.1 17.98,42.3 R1.1
  Bottom 0.406: IC2.1 17.94,45.27
N$2
  Bottom 0.305: IC2.3 15.45,43.24 12.3,40.1 R3.2 9.69,41.2 7.29,41.2 R4.1
N$3
  Bottom 0.305: CV_A.P$3 19.7,17.73 19.7,27.39 R8.1
N$4  (via drill 0.3)
  Top 0.305: v14.2,48.8 14.2,43.24 11.82,40.85 7.76,40.85 v6.2,39.29
  Bottom 0.305: R5.2 6.19,38.52 v6.19,39.28 | v6.19,39.28 R6.1 | v6.19,39.28 v6.2,39.29 | v14.2,48.8 14.2,50.41 IC2.5
  Bottom 0.406: 14.14,50.4 IC2.5
N$5
  Bottom 0.305: R12.1 12.3,1.6 13.6,2.9 13.6,14.4 15,15.8 16.6,15.8 18.8,18 18.8,24.7 16.8,26.7 16.8,39.3 18.9,41.4 18.9,46.7 17.1,48.5 15.8,48.5 15.45,48.85 IC2.6
  Bottom 0.406: IC2.6 15.45,52.24 R11.2
N$6
  Bottom 0.305: R30.1 16.33,1.6 CV_F.P$3
N$7
  Bottom 0.406: R15.2 12.49,68.15 C11.1 18.39,68.15 19.18,68.94 IC3.2
N$8
  Bottom 0.406: JP8.10 49.26,15.69 JP8.9 50.64,15.69 Q1.3
N$9
  Bottom 0.305: R2.1 12,14.2 13.9,16.1 13.9,24.5 16.19,26.79 R1.2 16.2,42.9 16.71,43.41 IC2.2
N$10
  Bottom 0.305: IC2.7 16.71,52.67 R11.1 16.7,53.8 16.1,54.4 6.9,54.4 5.99,53.49 R10.2
N$11
  Bottom 0.406: R18.2 13.34,72.3 13.82,72.78 | IC3.3 17.91,72.23 17.14,73 14.44,73 14.12,72.98 13.82,72.78 | C21.1 13.82,72.78
N$12
  Bottom 0.406: JP8.1 49.26,25.85 | 49.26,25.85 JP8.2 | Q2.3 49.41,25.7 49.26,25.85
N$13
  Bottom 0.305: R23.1 23.3,29.29 R8.2 19.92,29.31 R9.2
  Bottom 0.406: IC4.13 23.82,29.07 R23.1
N$14  (via drill 0.3)
  Top 0.305: v13.1,83.6 20.9,83.6 21.4,83.1 v21.4,76.9
  Bottom 0.305: POT_A.2 13.12,83.62 v13.1,83.6 | R9.1 19.7,31.4 21.2,32.9 21.2,34.8 18.6,37.4 18.6,40.4 21.5,43.3 21.5,76.2 21.4,76.3 v21.4,76.9
N$15
  Bottom 0.406: 9.04,72.3 R18.1 R17.2 9.29,70 C13.1 R19.2
N$16
  Bottom 0.305: D1.3 38.84,89.75 R39.2
  Bottom 0.406: R40.1 R39.2
N$17  (via drill 0.3)
  Top 0.305: v35,39.3 35,31.2 34.1,30.3 v25,30.3
  Bottom 0.305: R40.2 32.2,90.4 31.5,89.7 31.5,77.9 35.9,73.5 35.9,41.2 35,40.3 v35,39.3 | R23.2 24.31,30.99 v25,30.3 26.43,30.3 IC4.14
N$18
  Bottom 0.406: R28.2 12.84,80.05 C16.2 16.69,80.05 17.09,79.65 | IC3.7 19.18,77.56 17.09,79.65 | R27.1 17.09,79.65
N$19  (via drill 0.35)
  Top 0.305: v37.81,15.3 37.83,15.28 40.75,15.28 CV_B.P$3
  Bottom 0.305: R31.1 36.6,29.19 37.81,27.98 v37.81,15.3
N$20
  Bottom 0.305: R24.1 34.76,29.25 R31.2 38.08,29.21 R32.2
  Bottom 0.406: IC4.2 34.42,29.07 R24.1
N$21
  Bottom 0.305: R32.1 38.2,33.2 36.1,35.3 36.1,37.6 40,41.5 40,59.1 41.2,60.3 43.8,60.3 45,61.5 45,65.3 49.74,70.04 49.74,85.96 49.3,86.4 46.42,86.4 POT_B.2
N$22  (via drill 0.3)
  Top 0.305: v33.7,31 34.2,31.5 v34.2,38.7
  Bottom 0.305: IC4.1 33.04,30.34 v33.7,31 34.55,31 R24.2 34.6,31.05 | R42.2 32.5,92.3 30.8,90.6 30.8,77.6 35.2,73.2 35.2,41.5 34.2,40.5 v34.2,38.7
N$23  (via drill 0.3)
  Top 0.305: v36.54,92 36.6,91.9 36.6,88.5 v36.54,88.5
  Bottom 0.305: D2.3 v36.54,88.5
  Bottom 0.406: R42.1 36.24,92.3 v36.54,92 36.84,92.3 R41.2
N$24
  Bottom 0.406: R26.2 R28.1 R25.1 10.69,78.4 C18.1
N$25
  Bottom 0.305: C23.2 21.6,3.45 R30.2
  Bottom 0.406: C23.2 R34.1 24.45,22.75 25.02,22.72 IC4.8
N$26
  Bottom 0.406: IC3.6 17.91,77.44 16.99,78.35 C16.1 arc90 14.79,78.5 R25.2
N$27
  Top 0.305: X5.VBUS 18.43,36.7 JP13.2
N$28
  Bottom 0.305: CV_G.P$3 39.88,1.63 R33.1
N$29
  Bottom 0.305: R35.2 21.5,23.95 C23.1
  Bottom 0.406: IC4.9 23.74,23.99 R34.2 C23.1
N$30
  Bottom 0.406: 16.54,75 16.64,75 | IC3.5 16.54,75.7 16.54,75 | 16.54,75 16.54,74.9 16.08,74.44 C22.1 13.8,74.5 R20.2
N$31
  Bottom 0.305: C24.2 36.5,3.25 R33.2
  Bottom 0.406: IC4.7 33.08,22.72 33.65,22.75 R36.1 C24.2
N$32
  Bottom 0.406: C14.1 10.49,76.3 R21.2 10.84,76 10.84,74.2 10.89,74.55 R20.1 10.59,74.3 R22.2
N$33
  Bottom 0.305: R37.2 36.6,23.95 C24.1
  Bottom 0.406: IC4.6 34.6,23.99 R36.2 C24.1
N$37
  Bottom 0.254: R50.2 32,15.65 Q3.1
  Bottom 0.305: R49.2 R50.2
N$39
  Bottom 0.406: R14.2 12.49,66.45 C11.2 18.69,66.45 R13.1 18.74,66.6 18.74,66.8 20.44,68.45 20.44,70.5 IC3.1
N$40  (via drill 0.3)
  Top 0.254: v26.3,59.8 27.32,59.8 LED1.P1
  Bottom 0.254: R43.1 22.58,93.72 23,93.3 24.6,93.3 27.1,90.8 27.1,75.7 24.4,73 24.4,61.7 v26.3,59.8
N$41
  Bottom 0.406: R15.1 R14.1 9.39,65.8 R16.2 C10.1 9.29,67.9 10.7,67.9
N$42  (via drill 0.3)
  Top 0.305: LED1.P2 30.65,59.8 v45.6,59.8
  Bottom 0.254: R45.1 52.26,71.76 45.6,65.1 45.6,59.9 arc-90 v45.6,59.8
N$43  (via drill 0.3)
  Top 0.305: LED1.P4 26.3,61.27 v26.3,61.3
  Bottom 0.254: v26.3,61.3 24.9,62.7 24.9,72.8 27.6,75.5 27.6,91 25.12,93.48 R44.1
N$46
  Bottom 0.305: R50.1 32.8,18.13 TRA.P$3
N$47
  Bottom 0.305: R38.1 31.55,11.2 Q903.1
N$51
  Bottom 0.305: R903.1 31.56,4.89 R902.2 31.65,5.25 32.5,6.1 Q903.3
OUT_L  (via drill 0.3)
  Top 0.254: v19.7,56.3 v31.5,56.3 | v31.5,42.6 v42.5,42.6 | v42.5,39.3 54.6,39.3 56.6,37.3 56.6,16.53 OUT_L.P$3
  Bottom 0.254: R13.2 20.49,65.69 19.7,64.9 v19.7,56.3 | v31.5,56.3 v31.5,42.6 | v42.5,42.6 v42.5,39.3
OUT_R  (via drill 0.3)
  Top 0.254: OUT_R.P$3 56.6,3.83 56.6,12.4 55.8,13.2 53.6,13.2 52.1,14.7 52.1,20.3 53.3,21.5 55.6,21.5 56.1,22 56.1,37.1 54.4,38.8 43,38.8 42.7,38.5 41.9,38.5 41.6,38.8 v41.6,39.3 | v41.6,42 v30.8,42 | v30.8,55.6 v19,55.6 | v19,61.9 19.7,62.6 19.7,79.9 v18.8,80.8
  Bottom 0.254: v41.6,39.3 v41.6,42 | v30.8,42 v30.8,55.6 | v19,55.6 v19,61.9 | v18.8,80.8 R27.2
TROUT
  Bottom 0.305: R903.2 R904.2 arc90 31.22,1.63 TRF.P$3
USBD_DM
  Top 0.254: USB.3 55.64,54.94 53.3,52.6 53.3,42.1 51.9,40.7 19.7,40.7 17.1,38.1 13.2,38.1 11.83,36.73
  Top 0.305: X5.D- 11.83,36.73
USBD_DP
  Top 0.254: USB.2 54.34,56.6 54.34,54.54 52.7,52.9 52.7,42.4 51.6,41.3 19.5,41.3 16.9,38.7 11.8,38.7 10.5,37.4 10.5,34.82 X5.D+
USBD_VBUS
  Top 0.305: USB.4 54,51.18 54,41.7 52.3,40 24.23,40 23.07,38.84 JP13.1
USBH_DM  (via drill 0.3)
  Top 0.254: 53.1,55.3 52.1,54.3 52.1,42.7 51.4,42 v49.9,42
  Top 0.406: JP14.1 53.1,55.3
  Bottom 0.254: v49.9,42 45.9,38 45.9,33.95 X3.2
USBH_DP  (via drill 0.3)
  Top 0.254: JP14.2 51.5,56.3 51.5,43.1 51,42.6 49.2,42.6 v48.7,42.1
  Bottom 0.254: 43.9,33.95 X3.3 43.88,37.38 v48.7,42.1
USBH_VBUS
  Bottom 0.406: X3.1 48.35,33.9 | X3.1 48.35,33.95 48.35,37.1 52.8,41.55 52.8,53.2 51.6,54.4 51.6,61.48 JP14.4 | C25.2 C26.2 48.9,32.05 U3.6 47.65,33.2 X3.1

### Text on the board
tPlace: Rebel Technology | EuroWizard Rev02
bPlace: Rebel Technology | EuroWizard Rev02 | -12V